# EAGLE design MagJack_Breakout (EAGLE 6.5.0)
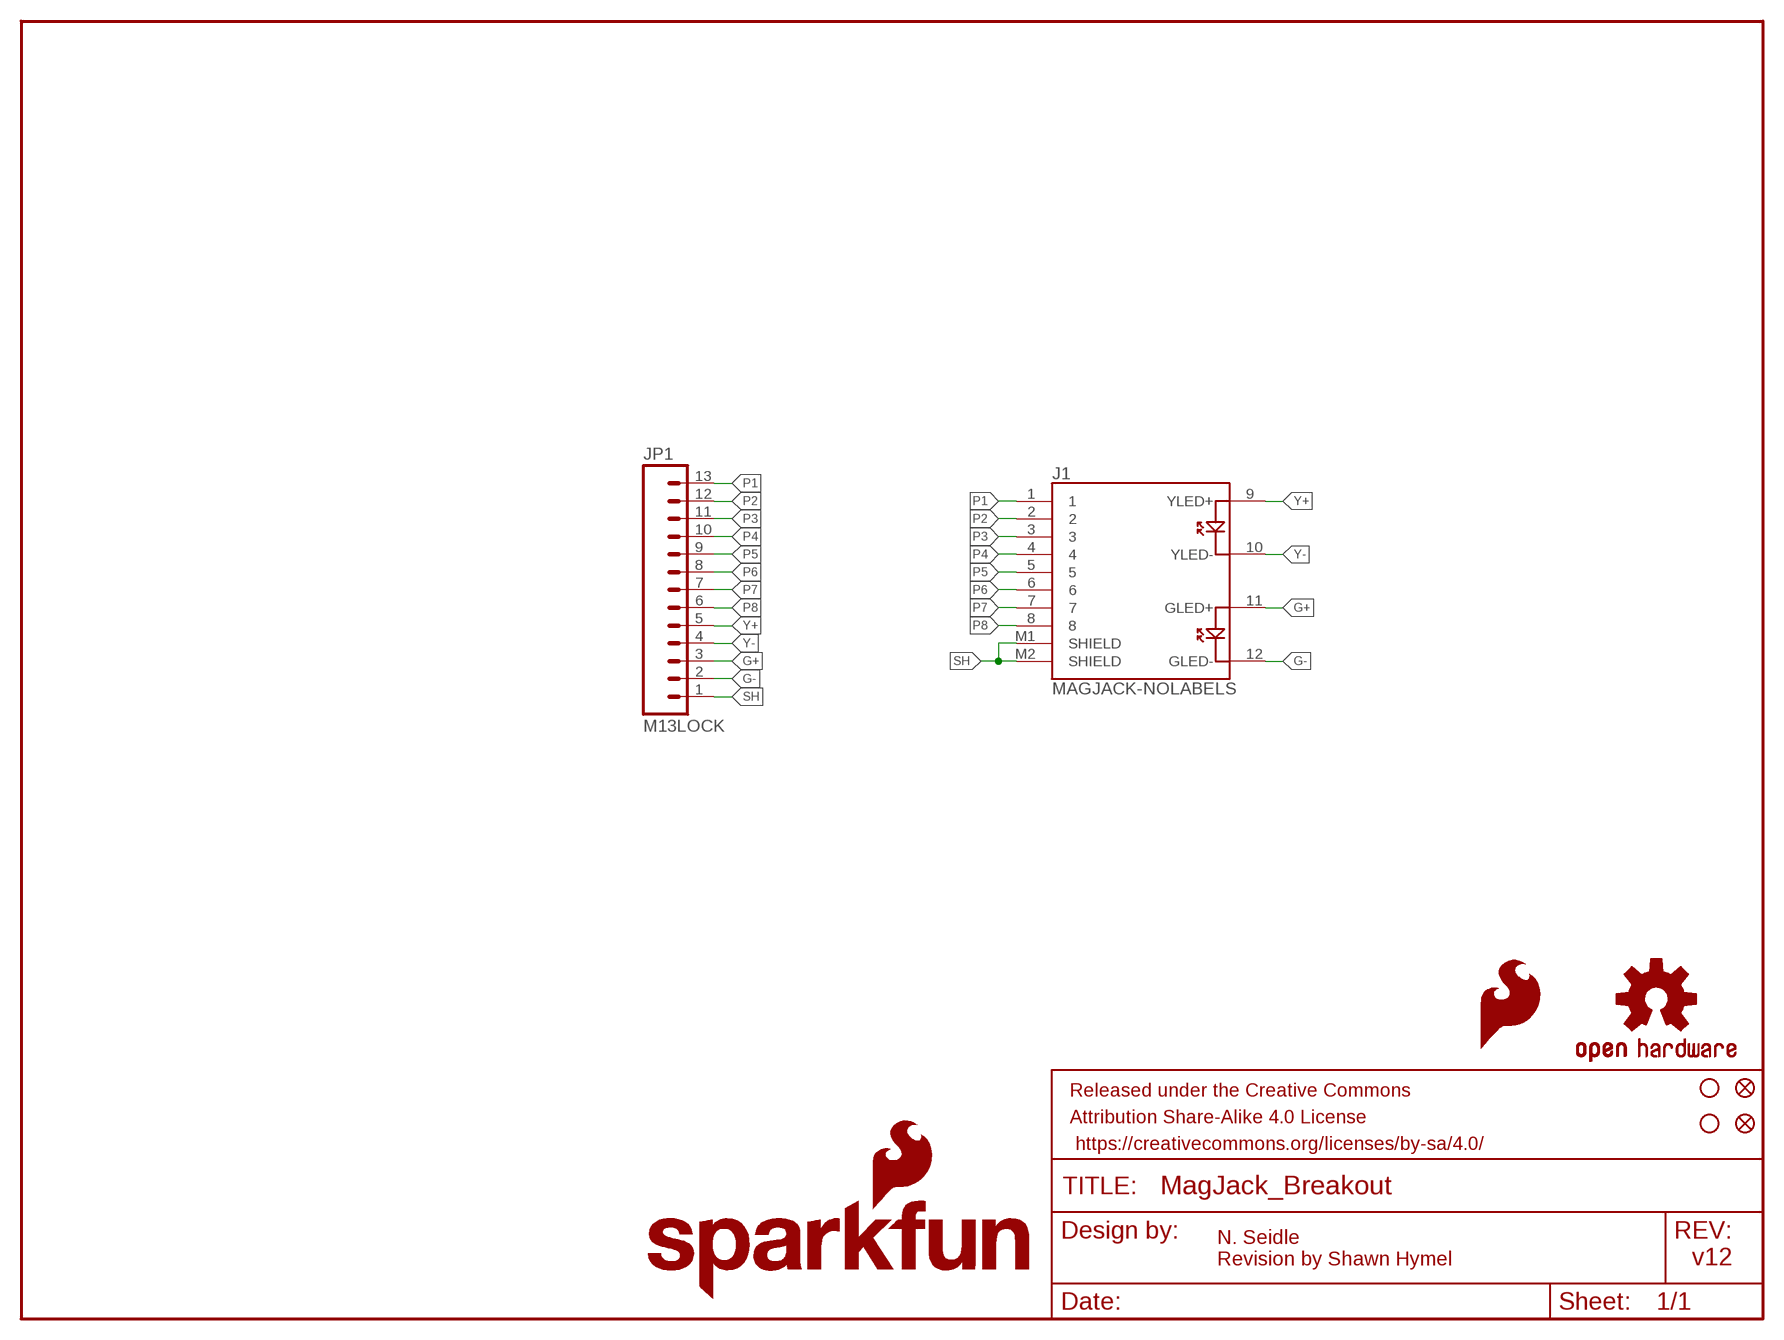
[diagram p0: schematic, sheet 1]

## Parts
FID1  FIDUCIAL1X2  [FIDUCIAL-1X2]
FID2  FIDUCIAL1X2  [FIDUCIAL-1X2]
FRAME1  FRAME-LETTER  [CREATIVE_COMMONS]
J1  MAGJACK-NOLABELS  [MAGJACK]
JP1  M13LOCK  [1X13_LOCK]
LOGO1  OSHW-LOGOS  [OSHW-LOGO-S]
LOGO2  SFE_LOGO_FLAME.1_INCH  [SFE_LOGO_FLAME_.1]
LOGO3  SFE_LOGO_NAME_FLAME.1_INCH  [SFE_LOGO_NAME_FLAME_.1]
STANDOFF3  STAND-OFF  [STAND-OFF]
STANDOFF5  STAND-OFF  [STAND-OFF]

## Nets
G+: J1.11(GLED+) JP1.3
G-: J1.12(GLED-) JP1.2
P1: J1.1 JP1.13
P2: J1.2 JP1.12
P3: J1.3 JP1.11
P4: J1.4 JP1.10
P5: J1.5 JP1.9
P6: J1.6 JP1.8
P7: J1.7 JP1.7
P8: J1.8 JP1.6
SH: J1.M1(SHIELD) J1.M2(SHIELD) JP1.1
Y+: J1.9(YLED+) JP1.5
Y-: J1.10(YLED-) JP1.4

## Notes on the sheet
- N. Seidle
  Revision by Shawn Hymel
- v12

## Library data of the parts
FID1 FID2 = SparkFun-Aesthetics:FIDUCIAL: Fiducial Alignment Points Various fiducial points for machine vision alignment.
FRAME1 = SparkFun-Aesthetics:FRAME-LETTER: Schematic Frame Standard 8.5x11 US Letter frame
J1 = SparkFun-Connectors:MAGJACK-NOLABELS; PROD_ID: CONN-09556
JP1 = SparkFun-Connectors:M13: 13-pin single row .1" header
LOGO1 = SparkFun-Aesthetics:OSHW-LOGO: Open Source Hardware Logo This logo indicates the piece of hardware it is found on incorporates a OSHW license and/or adheres to the definition of open source hardware found here: http://freedomdefined.org/OSHW
LOGO2 = SparkFun-Aesthetics:SFE_LOGO_FLAME: SFE Logo, flame only This is the SparkFun flame logo. The logo on the schematic will always be the same size; the package variant is the height of the flame. Default layer for the logo on the board is tSilk.
LOGO3 = SparkFun-Aesthetics:SFE_LOGO_NAME_FLAME: SFE Logo, name and flame This is the SparkFun full logo. The logo on the schematic will always be the same size; the package variant is the height of the flame part of the logo. Default layer for the logo on the board is tSilk.
STANDOFF3 STANDOFF5 = SparkFun-Electromechanical:STAND-OFF: #4 Stand Off This is the mechanical footprint for a #4 phillips button head screw. Use the keepout ring to avoid running the screw head into surrounding components. SKU : PRT-00447

## Board
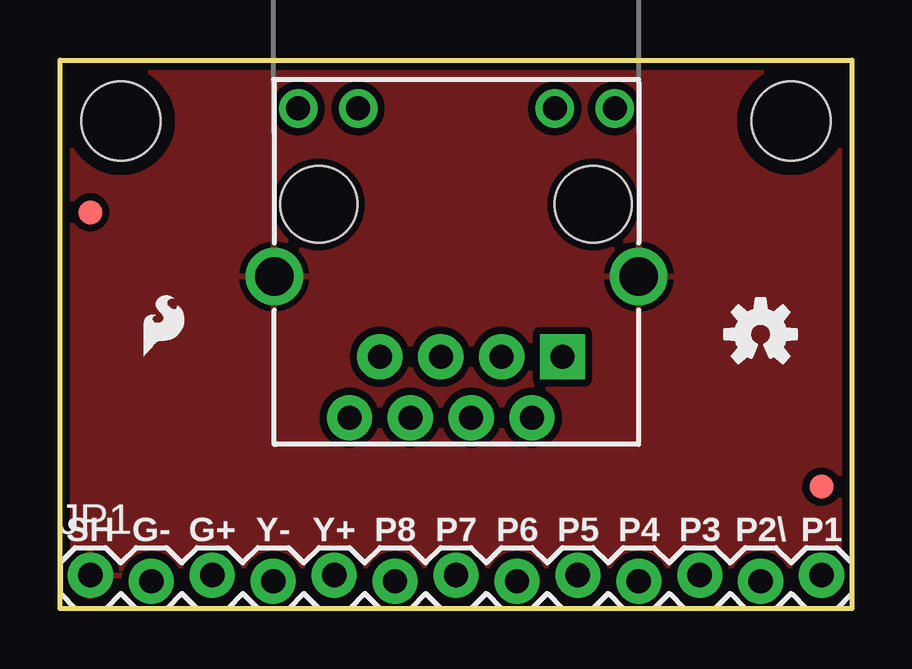
[diagram p1: board, top side]
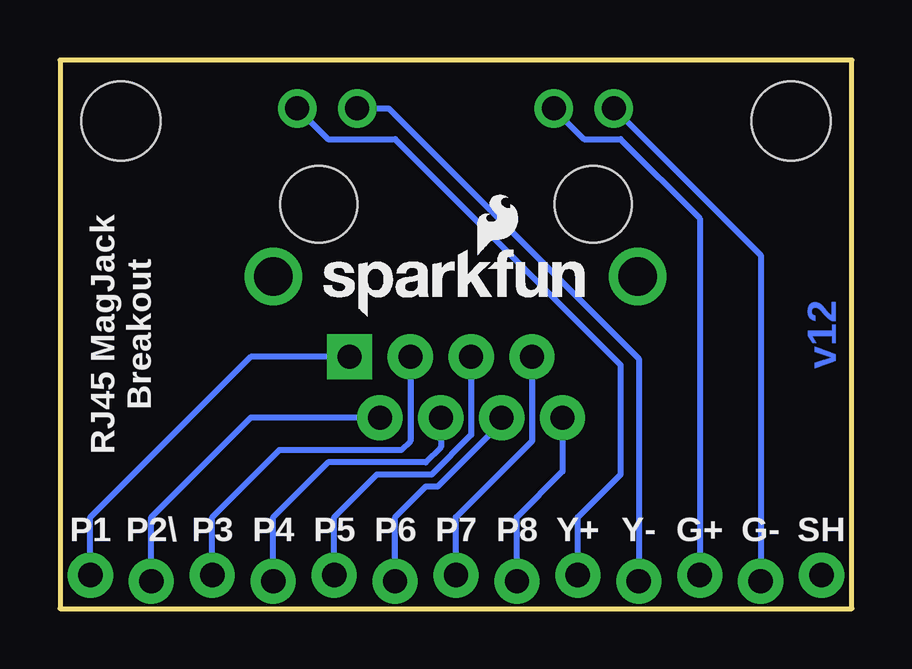
[diagram p2: board, bottom side, seen from below]

Size 33.02 x 22.86 mm. Coordinates in mm from the lower left corner, seen from the top.
Outline: 0,0 0,22.86 33.02,22.86 33.02,0 0,0
Copper layers (1*16): Top 0.035mm / dielectric 1.5mm / Bottom 0.035mm
Design rules "SparkFun-2-layer": minimum track width 7mil, minimum drill 15mil, track to track 8mil, track to pad 8mil, pad to pad 8mil, via to via 8mil, smd to smd 8mil, copper to edge 8mil, drill to drill 8mil, minimum pad ring 12mil, minimum via ring 10mil, stop-mask expansion 4mil, vias tented up to drill 20mil, thermal gap 10mil

### Footprints (pad centres in the part's own frame; a part is rotated, then mirrored left to right if it is on the bottom)
FIDUCIAL-1X2 = smd 1 x 1: 1 0,0
MAGJACK = drill 1 pad 1.88 square: 1 3.175,17.445 | drill 1 pad 1.88: 2 4.445,19.985; 3 5.715,17.445; 4 6.985,19.985; 5 8.255,17.445; 6 9.525,19.985; 7 10.795,17.445; 8 12.065,19.985 | drill 1 pad 1.27: 9 1,7.1; 10 3.5,7.1; 11 11.7,7.1; 12 14.2,7.1 | drill 1.6 pad 2.184: M1 0,14.1; M2 15.2,14.1 | hole 3.2: 1.905,11.095; 13.335,11.095
1X13_LOCK = drill 1.016 pad 1.88: 1 0,0.127; 2 2.54,-0.127; 3 5.08,0.127; 4 7.62,-0.127; 5 10.16,0.127; 6 12.7,-0.127; 7 15.24,0.127; 8 17.78,-0.127; 9 20.32,0.127; 10 22.86,-0.127; 11 25.4,0.127; 12 27.94,-0.127; 13 30.48,0.127
STAND-OFF = hole 3.302: 0,0

### Placement (x,y rotation side)
FID1  1.27,16.51 0 top
FID2  31.75,5.08 0 top
FRAME1  -17.78,-10.16 0 top  (outside the outline)
J1  24.13,27.94 180 top
JP1  1.27,1.27 0 top
LOGO1  29.21,11.43 0 top
LOGO2  3.17,10.16 0 top
LOGO3  22.48,12.06 0 bottom
STANDOFF3  30.48,20.32 0 top
STANDOFF5  2.54,20.32 0 top

### Tracks (layer width: path | path; a pad name or v marks a point on that pad's centre or on a via)
G+
  Bottom 0.254: J1.11 12.43,20.81 11.18,19.56 9.65,19.56 6.35,16.26 JP1.3
G-
  Bottom 0.254: J1.12 9.92,20.84 3.81,14.73 JP1.2
P1
  Bottom 0.254: J1.1 25.07,10.49 31.75,3.81 JP1.13
P2
  Bottom 0.254: J1.2 25.07,7.96 29.21,3.81 JP1.12
P3
  Bottom 0.254: J1.3 18.41,6.99 18.8,6.6 23.88,6.6 26.67,3.81 JP1.11
P4
  Bottom 0.254: J1.4 17.14,6.73 17.78,6.1 21.84,6.1 24.13,3.81 JP1.10
P5
  Bottom 0.254: J1.5 15.88,7.24 17.53,5.59 19.81,5.59 21.59,3.81 JP1.9
P6
  Bottom 0.254: J1.6 14.61,7.75 17.27,5.08 17.78,5.08 19.05,3.81 JP1.8
P7
  Bottom 0.254: J1.7 13.34,6.99 16.51,3.81 JP1.7
P8
  Bottom 0.254: J1.8 12.06,5.71 13.97,3.81 JP1.6
SH
  pour Top (isolate 0.305): 0,22.86 33.02,22.86 33.02,0 0,0
Y+
  Bottom 0.254: J1.9 21.84,19.56 19.05,19.56 9.65,10.16 9.65,5.59 11.43,3.81 JP1.5
Y-
  Bottom 0.254: J1.10 19.32,20.84 8.89,10.41 JP1.4

### Text on the board
Bottom: v12
tPlace: SH | G- | G+ | Y- | Y+ | P8 | P7 | P6 | P5 | P4 | P3 | P2\ | P1
bPlace: RJ45 MagJack / Breakout | SH | G- | G+ | Y- | Y+ | P8 | P7 | P6 | P5 | P4 | P3 | P2\ | P1
tDocu: N. Seidle / Revised by Shawn Hymel